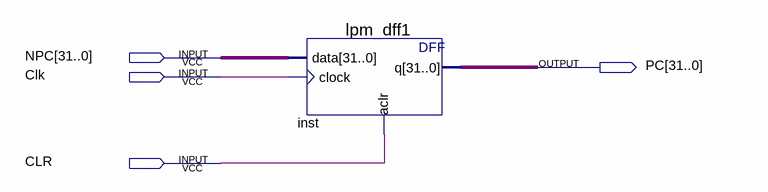
[diagram p0: schematic sheet]
// Quartus schematic PC.bdf as structural Verilog: 1 symbols, 4 pins
module PC (
  input  [31:0] NPC,
  input  Clk,
  input  CLR,
  output [31:0] PC
);

  lpm_dff1 inst (.data(NPC), .clock(Clk), .aclr(CLR), .q(PC));
endmodule
